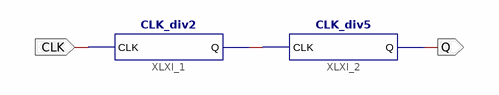
[diagram p0: schematic sheet 1]
// Xilinx ISE schematic CLK_div10.sch (spartan6) as structural Verilog: 2 symbols, 2 ports
module CLK_div10 (
  input  CLK,
  output Q
);

  wire XLXN_1;

  CLK_div2 XLXI_1 (.CLK(CLK), .Q(XLXN_1));
  CLK_div5 XLXI_2 (.CLK(XLXN_1), .Q(Q));
endmodule
